# EAGLE design hybri (EAGLE 6.4)
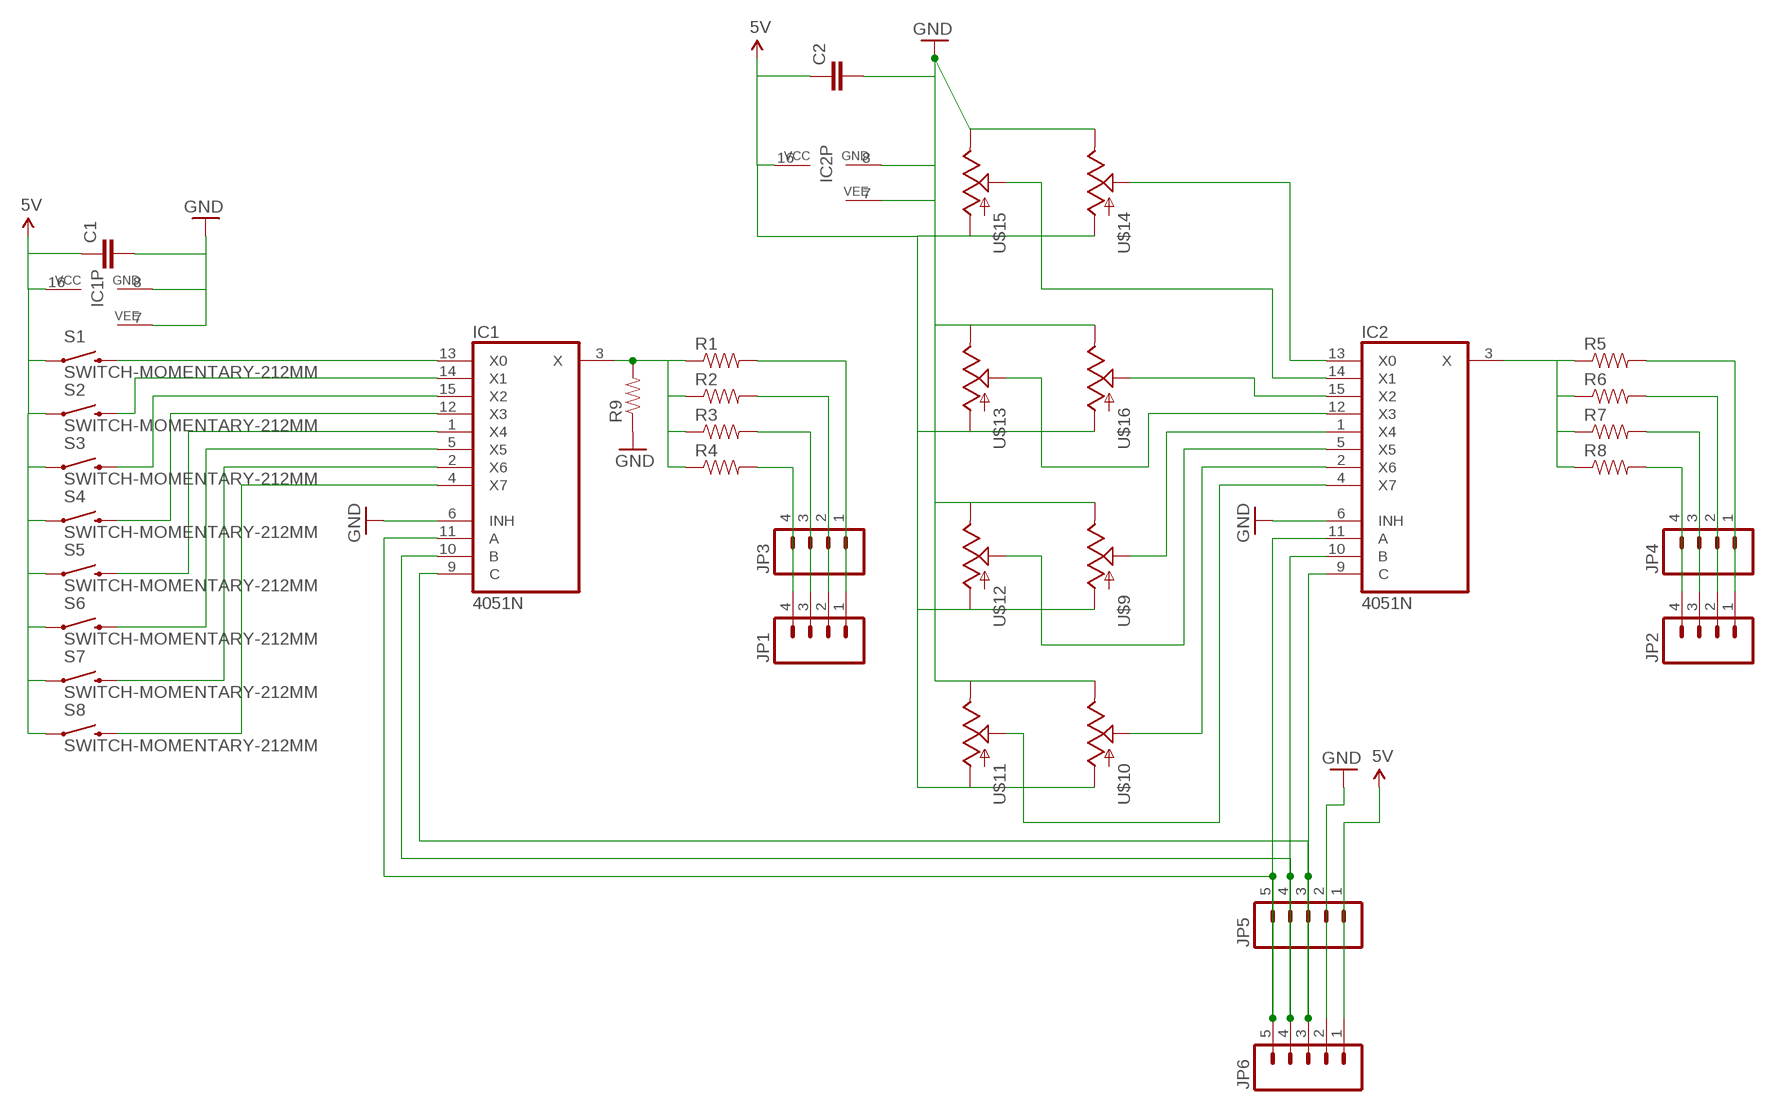
[diagram p0: schematic, sheet 1]

## Parts
C1  CAPPTH  [CAP-PTH-SMALL]
C2  CAPPTH  [CAP-PTH-SMALL]
IC1  4051N  [DIL16]
IC2  4051N  [DIL16]
JP1  M04PTH  [1X04]
JP2  M04PTH  [1X04]
JP3  M04PTH  [1X04]
JP4  M04PTH  [1X04]
JP5  M05PTH  [1X05]
JP6  M05PTH  [1X05]
R1  RESISTORAXIAL-0.3  [AXIAL-0.3]
R2  RESISTORAXIAL-0.3  [AXIAL-0.3]
R3  RESISTORAXIAL-0.3  [AXIAL-0.3]
R4  RESISTORAXIAL-0.3  [AXIAL-0.3]
R5  RESISTORAXIAL-0.3  [AXIAL-0.3]
R6  RESISTORAXIAL-0.3  [AXIAL-0.3]
R7  RESISTORAXIAL-0.3  [AXIAL-0.3]
R8  RESISTORAXIAL-0.3  [AXIAL-0.3]
R9  RESISTORAXIAL-0.3  [AXIAL-0.3]
S1  SWITCH-MOMENTARY-212MM  [TACTILE-PTH-12MM]
S2  SWITCH-MOMENTARY-212MM  [TACTILE-PTH-12MM]
S3  SWITCH-MOMENTARY-212MM  [TACTILE-PTH-12MM]
S4  SWITCH-MOMENTARY-212MM  [TACTILE-PTH-12MM]
S5  SWITCH-MOMENTARY-212MM  [TACTILE-PTH-12MM]
S6  SWITCH-MOMENTARY-212MM  [TACTILE-PTH-12MM]
S7  SWITCH-MOMENTARY-212MM  [TACTILE-PTH-12MM]
S8  SWITCH-MOMENTARY-212MM  [TACTILE-PTH-12MM]
U$9  POT  [ALPS_POT]
U$10  POT  [ALPS_POT]
U$11  POT  [ALPS_POT]
U$12  POT  [ALPS_POT]
U$13  POT  [ALPS_POT]
U$14  POT  [ALPS_POT]
U$15  POT  [ALPS_POT]
U$16  POT  [ALPS_POT]

## Nets
5V: C1.1 C2.1 IC1.16(VCC) IC2.16(VCC) JP5.1 JP6.1 S1.1 S2.1 S3.1 S4.1 S5.1 S6.1 S7.1 S8.1 U$9.P$3(A) U$10.P$3(A) U$11.P$3(A) U$12.P$3(A) U$13.P$3(A) U$14.P$3(A) U$15.P$3(A) U$16.P$3(A)
GND: C1.2 C2.2 IC1.6(INH) IC1.7(VEE) IC1.8(GND) IC2.6(INH) IC2.7(VEE) IC2.8(GND) JP5.2 JP6.2 R9.P$1 U$9.P$1(E) U$10.P$1(E) U$11.P$1(E) U$12.P$1(E) U$13.P$1(E) U$14.P$1(E) U$15.P$1(E) U$16.P$1(E)
N$1: IC1.13(X0) S1.3
N$2: IC1.14(X1) S2.3
N$3: IC1.15(X2) S3.3
N$4: IC1.12(X3) S4.3
N$5: IC1.1(X4) S5.3
N$6: IC1.5(X5) S6.3
N$7: IC1.2(X6) S7.3
N$8: IC1.4(X7) S8.3
N$9: IC2.13(X0) U$14.P$2(S)
N$10: IC2.14(X1) U$15.P$2(S)
N$11: IC2.15(X2) U$16.P$2(S)
N$12: IC2.12(X3) U$13.P$2(S)
N$13: IC2.1(X4) U$9.P$2(S)
N$14: IC2.5(X5) U$12.P$2(S)
N$15: IC2.2(X6) U$10.P$2(S)
N$16: IC2.4(X7) U$11.P$2(S)
N$17: IC1.3(X) R1.P$1 R2.P$1 R3.P$1 R4.P$1 R9.P$2
N$18: IC1.10(B) IC2.10(B) JP5.4 JP6.4
N$19: IC1.11(A) IC2.11(A) JP5.5 JP6.5
N$20: IC1.9(C) IC2.9(C) JP5.3 JP6.3
N$21: JP1.4 JP3.4 R4.P$2
N$22: JP1.3 JP3.3 R3.P$2
N$23: JP1.2 JP3.2 R2.P$2
N$24: JP1.1 JP3.1 R1.P$2
N$25: IC2.3(X) R5.P$1 R6.P$1 R7.P$1 R8.P$1
N$26: JP2.4 JP4.4 R8.P$2
N$27: JP2.3 JP4.3 R7.P$2
N$28: JP2.2 JP4.2 R6.P$2
N$29: JP2.1 JP4.1 R5.P$2

## Library data of the parts
C1 C2 = SparkFun-Passives:CAP: Capacitor Standard 0603 ceramic capacitor, and 0.1" leaded capacitor.
IC1 IC2 = 40xx:4051: 8-channel ANALOG MULTIPLEXER
JP1-JP4 = SparkFun-Connectors:M04: Header 4 Standard 4-pin 0.1" header. Use with straight break away headers (SKU : PRT-00116), right angle break away headers (PRT-00553), swiss pins (PRT-00743), machine pins (PRT-00117), and female headers (PRT-00115). Molex polarized connector foot print use with SKU : PRT-08231 with associated crimp pins and housings. 1MM SMD Version SKU: PRT-10208
JP5 JP6 = SparkFun-Connectors:M05: Header 5 Standard 5-pin 0.1" header. Use with straight break away headers (SKU : PRT-00116), right angle break away headers (PRT-00553), swiss pins (PRT-00743), machine pins (PRT-00117), and female headers (PRT-00115). Molex polarized connector foot print use with SKU : PRT-08230 with associated crimp pins and housings.
R1-R9 = SparkFun-Resistors:RESISTOR: Resistor Basic schematic elements and footprints for 0603, 1206, and PTH resistors.
S1-S8 = SparkFun-Electromechanical:SWITCH-MOMENTARY-2: Various NO switches- pushbuttons, reed, etc
U$9-U$16 = SparkFun-Electromechanical:POT

## Board
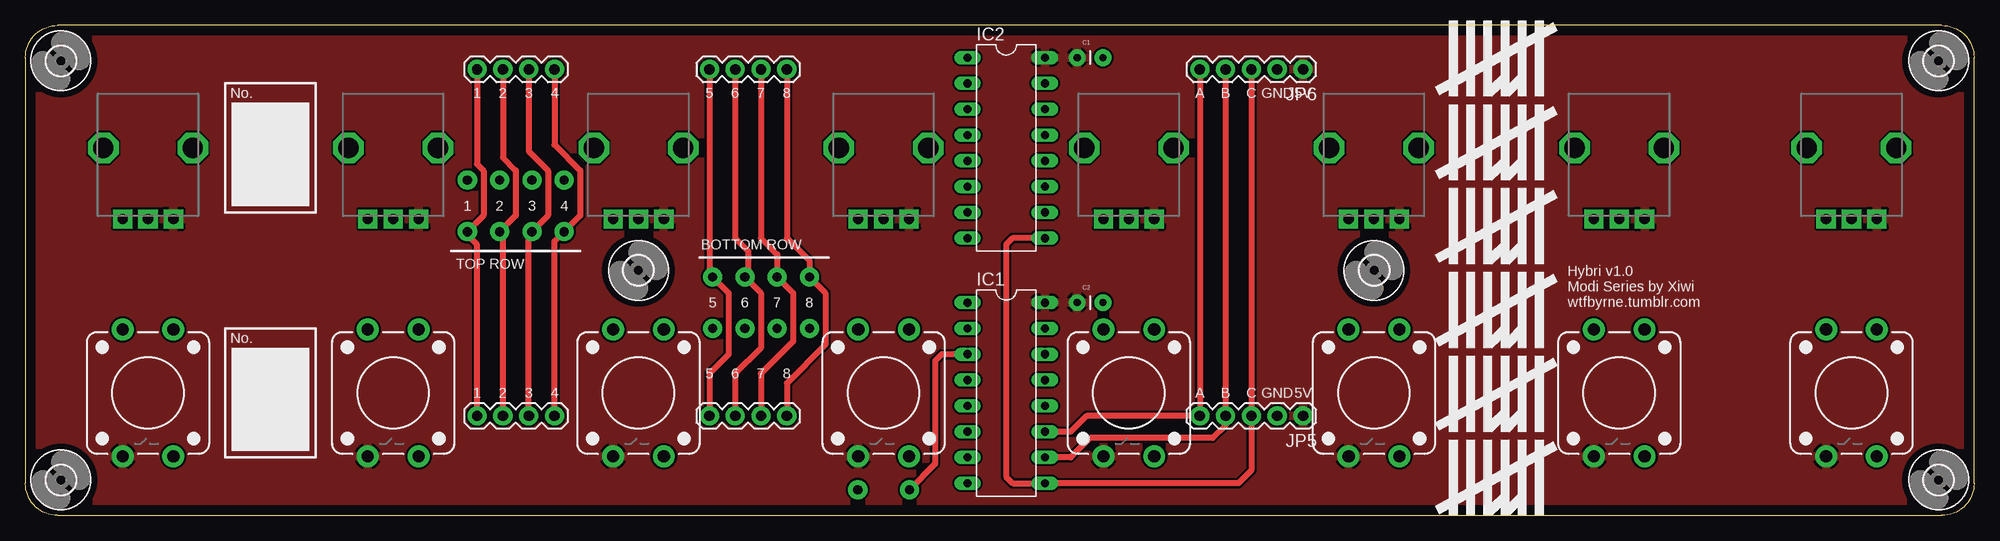
[diagram p1: board, top side]
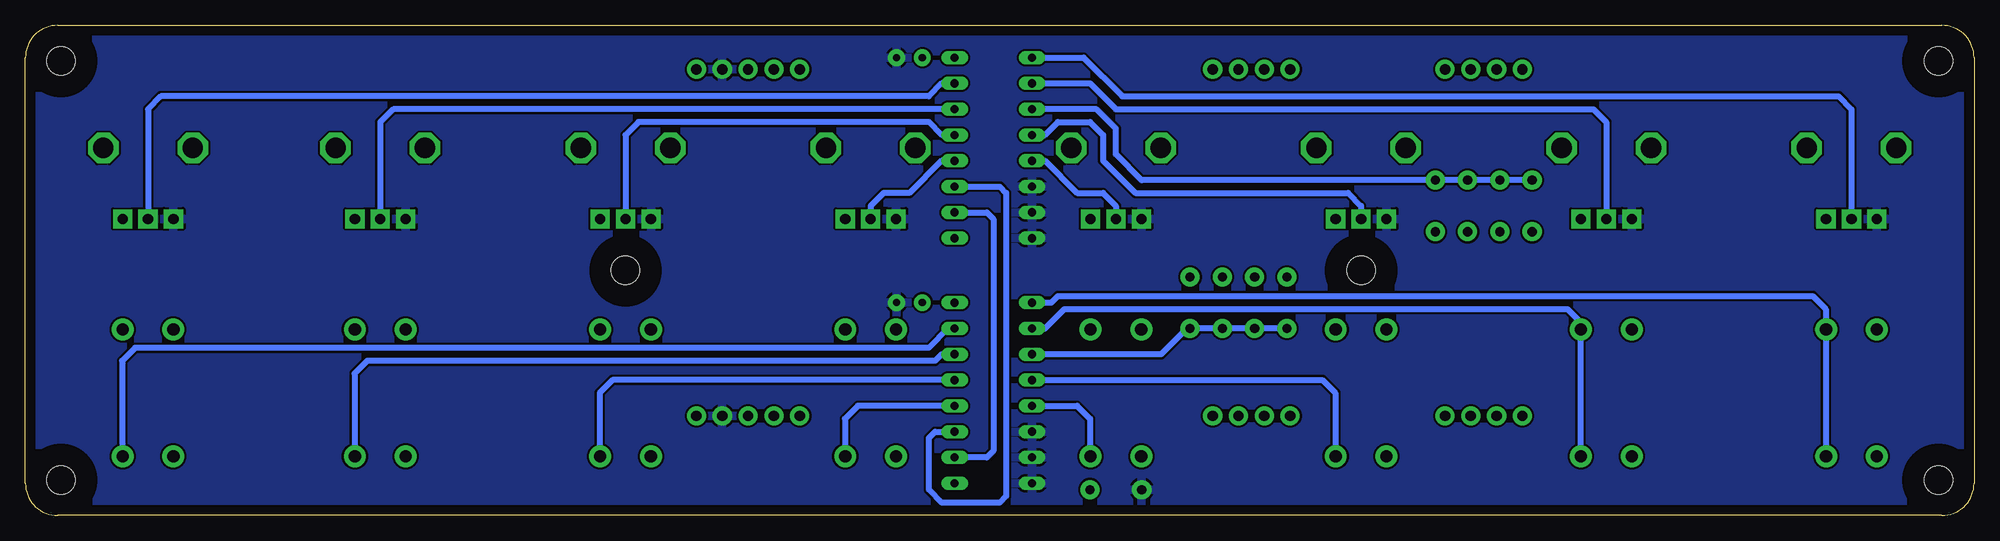
[diagram p2: board, bottom side, seen from below]

Size 191.77 x 48.26 mm. Coordinates in mm from the lower left corner, seen from the top.
Outline: 0,45.09 arc-90 3.17,48.26 188.59,48.26 arc-90 191.77,45.09 191.77,3.17 arc-90 188.59,0 3.17,0 arc-90 0,3.17 0,45.09
Copper layers (1*16): Top 0.035mm / dielectric 1.5mm / Bottom 0.035mm
Design rules "default": minimum track width 10mil, minimum drill 24mil, track to track 8mil, track to pad 8mil, pad to pad 8mil, via to via 8mil, smd to smd 8mil, copper to edge 40mil, drill to drill 8mil, minimum pad ring 10mil, minimum via ring 8mil, stop-mask expansion 4mil, vias tented up to drill 0mil, thermal gap 10mil

### Footprints (pad centres in the part's own frame; a part is rotated, then mirrored left to right if it is on the bottom)
CAP-PTH-SMALL = drill 0.7 pad 1.651: 1 0,0; 2 2.54,0
DIL16 = drill 0.813 long: 1 -8.89,-3.81; 2 -6.35,-3.81; 3 -3.81,-3.81; 4 -1.27,-3.81; 5 1.27,-3.81; 6 3.81,-3.81; 7 6.35,-3.81; 8 8.89,-3.81; 9 8.89,3.81; 10 6.35,3.81; 11 3.81,3.81; 12 1.27,3.81; 13 -1.27,3.81; 14 -3.81,3.81; 15 -6.35,3.81; 16 -8.89,3.81
1X04 = drill 1.016 pad 1.88: 1 0,0; 2 2.54,0; 3 5.08,0; 4 7.62,0
1X05 = drill 1.016 pad 1.88: 1 0,0; 2 2.54,0; 3 5.08,0; 4 7.62,0; 5 10.16,0
AXIAL-0.3 = drill 0.9 pad 1.88: P$1 -2.54,0; P$2 2.54,0
TACTILE-PTH-12MM = drill 1.2 pad 2.159: 1 6.25,-2.5; 2 -6.25,-2.5; 3 6.25,2.5; 4 -6.25,2.5
ALPS_POT = drill 1 pad 1.88 square: P$1 7,-2.5; P$2 7,0; P$3 7,2.5 | drill 2 octagon: P$4 0,-4.4; P$5 0,4.4
2,8 = hole 2.8: 0,0

### Placement (x,y rotation side)
C1  103.5,45.09 0 top
C2  103.5,20.95 0 top
IC1  96.52,12.06 270 top
IC2  96.52,36.2 270 top
JP1  67.31,9.8 0 top
JP2  44.45,9.8 0 top
JP3  67.31,43.93 0 top
JP4  44.45,43.93 0 top
JP5  125.73,9.8 180 top
JP6  125.73,43.93 180 top
R1  67.63,20.95 90 top
R2  70.8,20.95 90 top
R3  73.98,20.95 90 top
R4  77.15,20.95 90 top
R5  43.5,30.48 270 top
R6  46.67,30.48 270 top
R7  49.85,30.48 270 top
R8  53.02,30.48 270 top
R9  84.45,2.54 0 top
S1  132.72,12.06 270 top
S2  156.84,12.06 270 top
S3  179.71,12.06 270 top
S4  108.58,12.06 270 top
S5  12.06,12.06 270 top
S6  84.45,12.06 270 top
S7  36.2,12.06 270 top
S8  60.33,12.06 270 top
U$9  12.06,36.2 270 top
U$10  36.2,36.2 270 top
U$11  60.33,36.2 270 top
U$12  84.45,36.2 270 top
U$13  108.58,36.2 270 top
U$14  132.72,36.2 270 top
U$15  156.84,36.2 270 top
U$16  179.71,36.2 270 top
U$17  [2,8]  3.49,44.77 0 top
U$18  [2,8]  3.49,3.49 0 top
U$19  [2,8]  188.28,44.77 0 top
U$20  [2,8]  188.28,3.49 0 top
U$21  [2,8]  60.33,24.13 0 top
U$22  [2,8]  132.72,24.13 0 top
U$23  [XIWI]  138.75,33.02 0 top
U$24  [XIWI]  138.75,24.77 0 top
U$25  [XIWI]  138.75,41.27 0 top
U$26  [XIWI]  138.75,16.51 0 top
U$27  [XIWI]  138.75,8.26 0 top
U$28  [XIWI]  138.75,0 0 top

### Tracks (layer width: path | path; a pad name or v marks a point on that pad's centre or on a via)
5V
  pour Top: -2.54,50.8 194.31,50.8 194.31,-2.54 -2.54,-2.54
GND
  pour Bottom: 0,48.26 191.77,48.26 191.77,0 0,0
N$1
  Bottom 0.61: IC1.13 133.99,13.34 135.25,12.06 135.25,5.86 S1.3
N$2
  Bottom 0.61: IC1.14 101.6,15.88 102.23,15.24 158.12,15.24 159.38,13.97 159.38,5.86 S2.3
N$3
  Bottom 0.61: IC1.15 100.97,18.41 102.87,16.51 180.97,16.51 182.25,15.24 182.25,5.86 S3.3
N$4
  Bottom 0.61: IC1.12 109.86,10.79 111.12,9.53 111.12,5.86 S4.3
N$5
  Bottom 0.61: IC1.1 90.81,20.95 90.17,21.59 15.88,21.59 14.61,20.32 14.61,5.86 S5.3
N$6
  Bottom 0.61: IC1.5 88.27,10.79 87,9.53 87,5.86 S6.3
N$7
  Bottom 0.61: IC1.2 91.44,18.41 89.53,20.32 40.01,20.32 38.73,19.05 38.73,5.86 S7.3
N$8
  Bottom 0.61: IC1.4 64.14,13.34 62.87,12.06 62.87,5.86 S8.3
N$9
  Bottom 0.61: IC2.13 101.6,37.47 102.87,38.73 131.44,38.73 132.72,37.47 U$14.P$2
N$10
  Bottom 0.61: IC2.14 155.57,40.01 156.84,38.73 U$15.P$2
N$11
  Bottom 0.61: IC2.15 101.6,42.55 102.87,41.27 178.44,41.27 179.71,40.01 U$16.P$2
N$12
  Bottom 0.61: IC2.12 101.6,34.92 104.78,31.75 107.31,31.75 108.58,30.48 U$13.P$2
N$13
  Bottom 0.61: IC2.1 87.63,45.09 83.82,41.27 13.34,41.27 12.06,40.01 U$9.P$2
N$14
  Bottom 0.61: IC2.5 91.44,34.92 88.27,31.75 85.72,31.75 84.45,30.48 U$12.P$2
N$15
  Bottom 0.61: IC2.2 87,42.55 84.45,40.01 37.47,40.01 36.2,38.73 U$10.P$2
N$16
  Bottom 0.61: IC2.4 91.44,37.47 90.17,38.73 87,38.73 85.72,37.47 85.72,34.92 82.55,31.75 61.59,31.75 60.33,30.48 U$11.P$2
N$17
  Top 0.61: IC1.3 90.17,15.88 89.53,15.24 89.53,5.08 R9.P$2
  Bottom 0.61: R1.P$1 R2.P$1 R3.P$1 R4.P$1 77.47,18.41 80.01,15.88 IC1.3
N$18
  Top 0.61: JP6.4 JP5.4 118.11,8.89 116.84,7.62 104.78,7.62 102.87,5.71 IC1.10
  Bottom 0.61: IC2.10 97.16,29.84 96.52,29.21 96.52,6.35 97.16,5.71 IC1.10
N$19
  Top 0.61: JP6.5 JP5.5 104.42,9.8 102.87,8.26 IC1.11
  Bottom 0.61: IC2.11 95.89,32.38 95.25,31.75 95.25,1.91 95.89,1.27 101.6,1.27 102.87,2.54 102.87,7.62 102.23,8.26 IC1.11
N$20
  Top 0.61: JP6.3 JP5.3 120.65,4.45 119.38,3.17 IC1.9 97.16,3.17 96.52,3.81 96.52,26.67 97.16,27.3 IC2.9
N$21
  Top 0.61: JP3.4 74.93,27.3 77.15,25.08 R4.P$2 78.74,21.91 78.74,16.83 74.93,13.02 JP1.4
N$22
  Top 0.61: JP3.3 72.39,27.3 73.98,25.72 R3.P$2 75.56,21.91 75.56,17.14 72.39,13.97 JP1.3
N$23
  Top 0.61: JP3.2 69.85,27.3 71.12,26.04 71.12,23.81 R2.P$2 72.39,21.91 72.39,16.51 69.85,13.97 JP1.2
N$24
  Top 0.61: JP3.1 67.31,23.81 R1.P$2 69.22,21.91 69.22,15.88 67.31,13.97 JP1.1
N$25
  Bottom 0.61: R5.P$1 R6.P$1 R7.P$1 R8.P$1 81.92,33.02 84.45,35.56 84.45,38.1 86.36,40.01 IC2.3
N$26
  Top 0.61: JP2.4 52.07,26.99 R8.P$2 54.61,29.53 54.61,33.97 52.07,36.51 JP4.4
N$27
  Top 0.61: JP2.3 49.53,27.3 49.85,27.62 R7.P$2 51.44,29.53 51.44,33.97 49.53,35.88 JP4.3
N$28
  Top 0.61: JP2.2 46.99,27.3 46.67,27.62 R6.P$2 48.26,29.53 48.26,33.97 46.99,35.24 JP4.2
N$29
  Top 0.61: JP2.1 44.45,26.67 43.5,27.62 R5.P$2 45.09,29.53 45.09,33.97 44.45,34.61 JP4.1

### Text on the board
tPlace: No. | 1 | 2 | 3 | 4 | 5 | 6 | 7 | 8 | A | B | C | GND | 5V | 1 | 2 | 3 | 4 | BOTTOM ROW | TOP ROW | Hybri v1.0 / Modi Series by Xiwi / wtfbyrne.tumblr.com | 5 | 6 | 7 | 8 | No. | 5 | 6 | 7 | 8 | 1 | 2 | 3 | 4 | A | B | C | GND | 5V